# Altium schematic sheet Sheet1.SchDoc
size A4; PageSetup: Record=PageOptions|CenterHorizontal=True|CenterVertical=True|PrintScale=1.00|XCorrection=1.00|YCorrection=1.00|PrintKind=0|BorderSize=5000000|LeftOffset=0|BottomOffset=0|Orientation=2|PaperLength=1000|PaperWidth=1000|Scale=100|PaperSource=7|PrintQuality=-3|MediaType=1|DitherType=10|PrintScaleMode=1|PaperKind=A4|PaperIndex=9
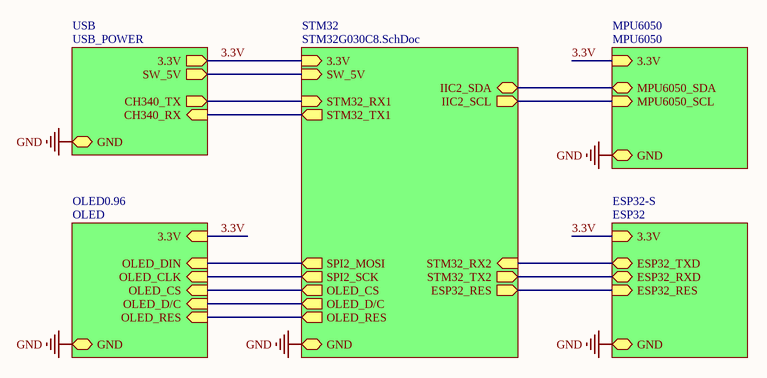
[diagram p0: Sheet1.SchDoc]

## Sub-sheets
ESP32-S = ESP32: ESP32_RES (in), 3.3V (in), ESP32_TXD, GND, ESP32_RXD
MPU6050 = MPU6050: MPU6050_SDA, MPU6050_SCL (in), GND, 3.3V (in)
OLED0.96 = OLED: OLED_DIN (in), 3.3V (in), OLED_CS (in), OLED_RES (in), OLED_D/C (in), OLED_CLK (in), GND
STM32 = STM32G030C8.SchDoc: IIC2_SCL (out), SPI2_SCK (out), IIC2_SDA, OLED_CS (out), SPI2_MOSI (out), GND, 3.3V (in), ESP32_RES (out), OLED_D/C (out), OLED_RES (out), SW_5V (in), STM32_TX1 (out), STM32_RX1 (in), STM32_TX2 (out), STM32_RX2 (in)
USB = USB_POWER: GND, CH340_TX (out), SW_5V (out), CH340_RX (in), 3.3V (out)

## Nets
GND: sheet USB/GND, sheet STM32/GND, sheet OLED0.96/GND, sheet ESP32-S/GND, sheet MPU6050/GND
3.3V: sheet USB/3.3V, sheet STM32/3.3V, sheet OLED0.96/3.3V, sheet ESP32-S/3.3V, sheet MPU6050/3.3V
(unnamed): sheet USB/CH340_TX, sheet STM32/STM32_RX1
(unnamed): sheet USB/SW_5V, sheet STM32/SW_5V
(unnamed): sheet USB/CH340_RX, sheet STM32/STM32_TX1
(unnamed): sheet STM32/IIC2_SCL, sheet MPU6050/MPU6050_SCL
(unnamed): sheet STM32/SPI2_SCK, sheet OLED0.96/OLED_CLK
(unnamed): sheet STM32/IIC2_SDA, sheet MPU6050/MPU6050_SDA
(unnamed): sheet STM32/OLED_CS, sheet OLED0.96/OLED_CS
(unnamed): sheet STM32/SPI2_MOSI, sheet OLED0.96/OLED_DIN
(unnamed): sheet STM32/ESP32_RES, sheet ESP32-S/ESP32_RES
(unnamed): sheet STM32/OLED_D/C, sheet OLED0.96/OLED_D/C
(unnamed): sheet STM32/OLED_RES, sheet OLED0.96/OLED_RES
(unnamed): sheet STM32/STM32_TX2, sheet ESP32-S/ESP32_RXD
(unnamed): sheet STM32/STM32_RX2, sheet ESP32-S/ESP32_TXD